# Altium schematic sheet scs-check.SchDoc
size 297 x 209 mm
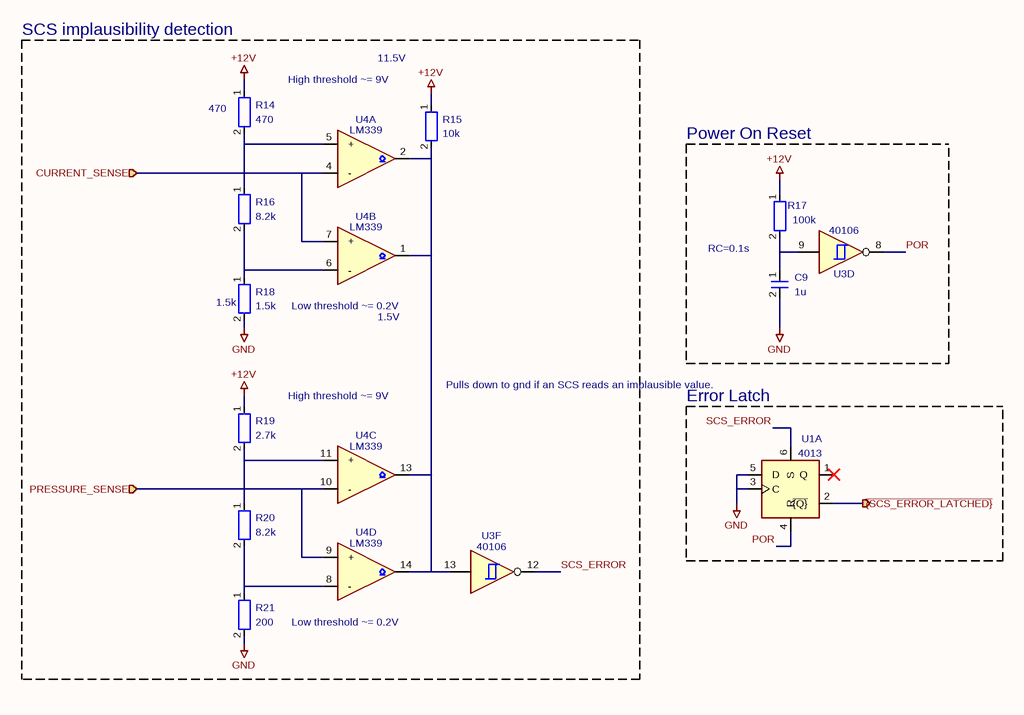
[diagram p0: scs-check.SchDoc]

## Parts
C9  1u  [C_0603_1608Metric]
R14  470  [R_0603_1608Metric]
R15  10k  [R_0603_1608Metric]
R16  8.2k  [R_0603_1608Metric]
R17  100k  [R_0603_1608Metric]
R18  1.5k  [R_0603_1608Metric]
R19  2.7k  [R_0603_1608Metric]
R20  8.2k  [R_0603_1608Metric]
R21  200  [R_0603_1608Metric]
U1  4013  [SOIC-14_3.9x8.7mm_P1.27mm]  (part A of 3)
U3  40106  [SOIC-14_3.9x8.7mm_P1.27mm]  (parts D,F of 7)
U4  LM339  [SOIC-14_3.9x8.7mm_P1.27mm]  (parts A,B,C,D of 5)

## Blocks framed on the sheet
SCS implausibility detection: R14-R16 R18-R21 U3 U4
Power On Reset: C9 R17 U3
Error Latch: U1

## Ports
CURRENT_SENSE (in), PRESSURE_SENSE (in), ~{{SCS_ERROR_LATCHED}} (out)

## Nets
+12V: R14.1 R15.1 R17.1 R19.1
GND: C9.2 R18.2 R21.2 U1.3(C) U1.5(D)
CURRENT_SENSE: U4.4(-) U4.7(+) ; port CURRENT_SENSE
POR: U1.4(R) U3.8
PRESSURE_SENSE: U4.9(+) U4.10(-) ; port PRESSURE_SENSE
SCS_ERROR: U1.6(S) U3.12
~{{SCS_ERROR_LATCHED}}: U1.2(~{{Q}}) ; port ~{{SCS_ERROR_LATCHED}}
NetC9_1: C9.1 R17.2 U3.9
NetR14_2: R14.2 R16.1 U4.5(+)
NetR15_2: R15.2 U3.13 U4.1 U4.2 U4.13 U4.14
NetR16_2: R16.2 R18.1 U4.6(-)
NetR19_2: R19.2 R20.1 U4.11(+)
NetR20_2: R20.2 R21.1 U4.8(-)

Not connected (* = marked no-connect by the designer): U1 1(Q)*

## Notes on the sheet
- 11.5V
- (near R14) 470
- High threshold ~= 9V
- RC=0.1s
- (near R18) 1.5k
- Low threshold ~= 0.2V
- (near U4) 1.5V
- Pulls down to gnd if an
  SCS reads an implausible
  value.
- 1
- 2
- 3
- 4
- 5
- 6
- A
- B
- C
- STAG 12
- Ray Wang, Joe Pater
- Marek Frodyma, Tim Brewis
- D
- Title: BSPD
- File: scs-check.kicad_sch
- Sheet: /
- SUFST - Southampton University Formula Student Team
- KiCad E.D.A.  kicad (5.1.4)-1
- Size: A4
- Date: 2025-12-14
- Rev: 1.3.0
- Id: 1/1

## Library data of the parts
C9 = C_Small: To Order: SHARED; Value: 1u; Footprint: Capacitor_SMD:C_0603_1608Metric
R14 R16 R18-R20 = R: To Order: TRUE; Footprint: Resistor_SMD:R_0603_1608Metric
  R14: Mouser Part Number: 603-RT0603FRD07470RL; Value: 470
  R16 R20: Mouser Part Number: 603-RT0603FRD078K2L; Value: 8.2k
  R18: Mouser Part Number: 603-RT0603FRE071K5L; Value: 1.5k
  R19: Mouser Part Number: 603-RT0603FRE072K7L; Value: 2.7k
R15 R17 R21 = R: To Order: INV; Footprint: Resistor_SMD:R_0603_1608Metric
  R15: Value: 10k
  R17: Value: 100k
  R21: Value: 200
U1 = 4013: Order Code: 863-MC14013BDR2G; To Order: INV; Supplier: Mouser; Value: 4013; Footprint: Package_SO:SOIC-14_3.9x8.7mm_P1.27mm
U3 = 40106: Order Code: 771-HEF40106BTD-T; To Order: INV; Supplier: Mouser; Value: 40106; Footprint: Package_SO:SOIC-14_3.9x8.7mm_P1.27mm
U4 = LM339: Order Code: 595-LM339DR; To Order: INV; Supplier: Mouser; Value: LM339; Footprint: Package_SO:SOIC-14_3.9x8.7mm_P1.27mm